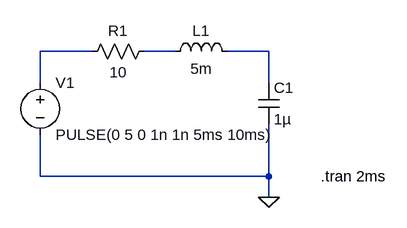
[diagram p0: schematic RLC_Circuit.asc]
RLC_Circuit.asc, the LTspice schematic file:
Version 4.1
SHEET 1 880 680
WIRE 32 96 -48 96
WIRE 160 96 112 96
WIRE 304 96 240 96
WIRE -48 144 -48 96
WIRE 304 144 304 96
WIRE -48 288 -48 224
WIRE 304 288 304 208
WIRE 304 288 -48 288
WIRE 304 320 304 288
FLAG 304 320 0
SYMBOL voltage -48 128 R0
WINDOW 123 0 0 Left 0
WINDOW 39 0 0 Left 0
SYMATTR InstName V1
SYMATTR Value PULSE(0 5 0 1n 1n 5ms 10ms)
SYMBOL res 128 80 R90
WINDOW 0 0 56 VBottom 2
WINDOW 3 32 56 VTop 2
SYMATTR InstName R1
SYMATTR Value 10
SYMBOL ind 144 112 R270
WINDOW 0 32 56 VTop 2
WINDOW 3 5 56 VBottom 2
SYMATTR InstName L1
SYMATTR Value 5m
SYMBOL cap 288 144 R0
SYMATTR InstName C1
SYMATTR Value 1µ
TEXT 384 288 Left 2 !.tran 2ms

The netlist it stands for:
* RLC_Circuit.asc
V1 N001 0 PULSE(0 5 0 1n 1n 5ms 10ms)
R1 N002 N001 10
L1 N002 N003 5m
C1 N003 0 1µ
.tran 2ms
.backanno
.end